# Altium schematic sheet SoC_Connector.SchDoc
size A3; SheetNumber: 4; SheetTotal: 6
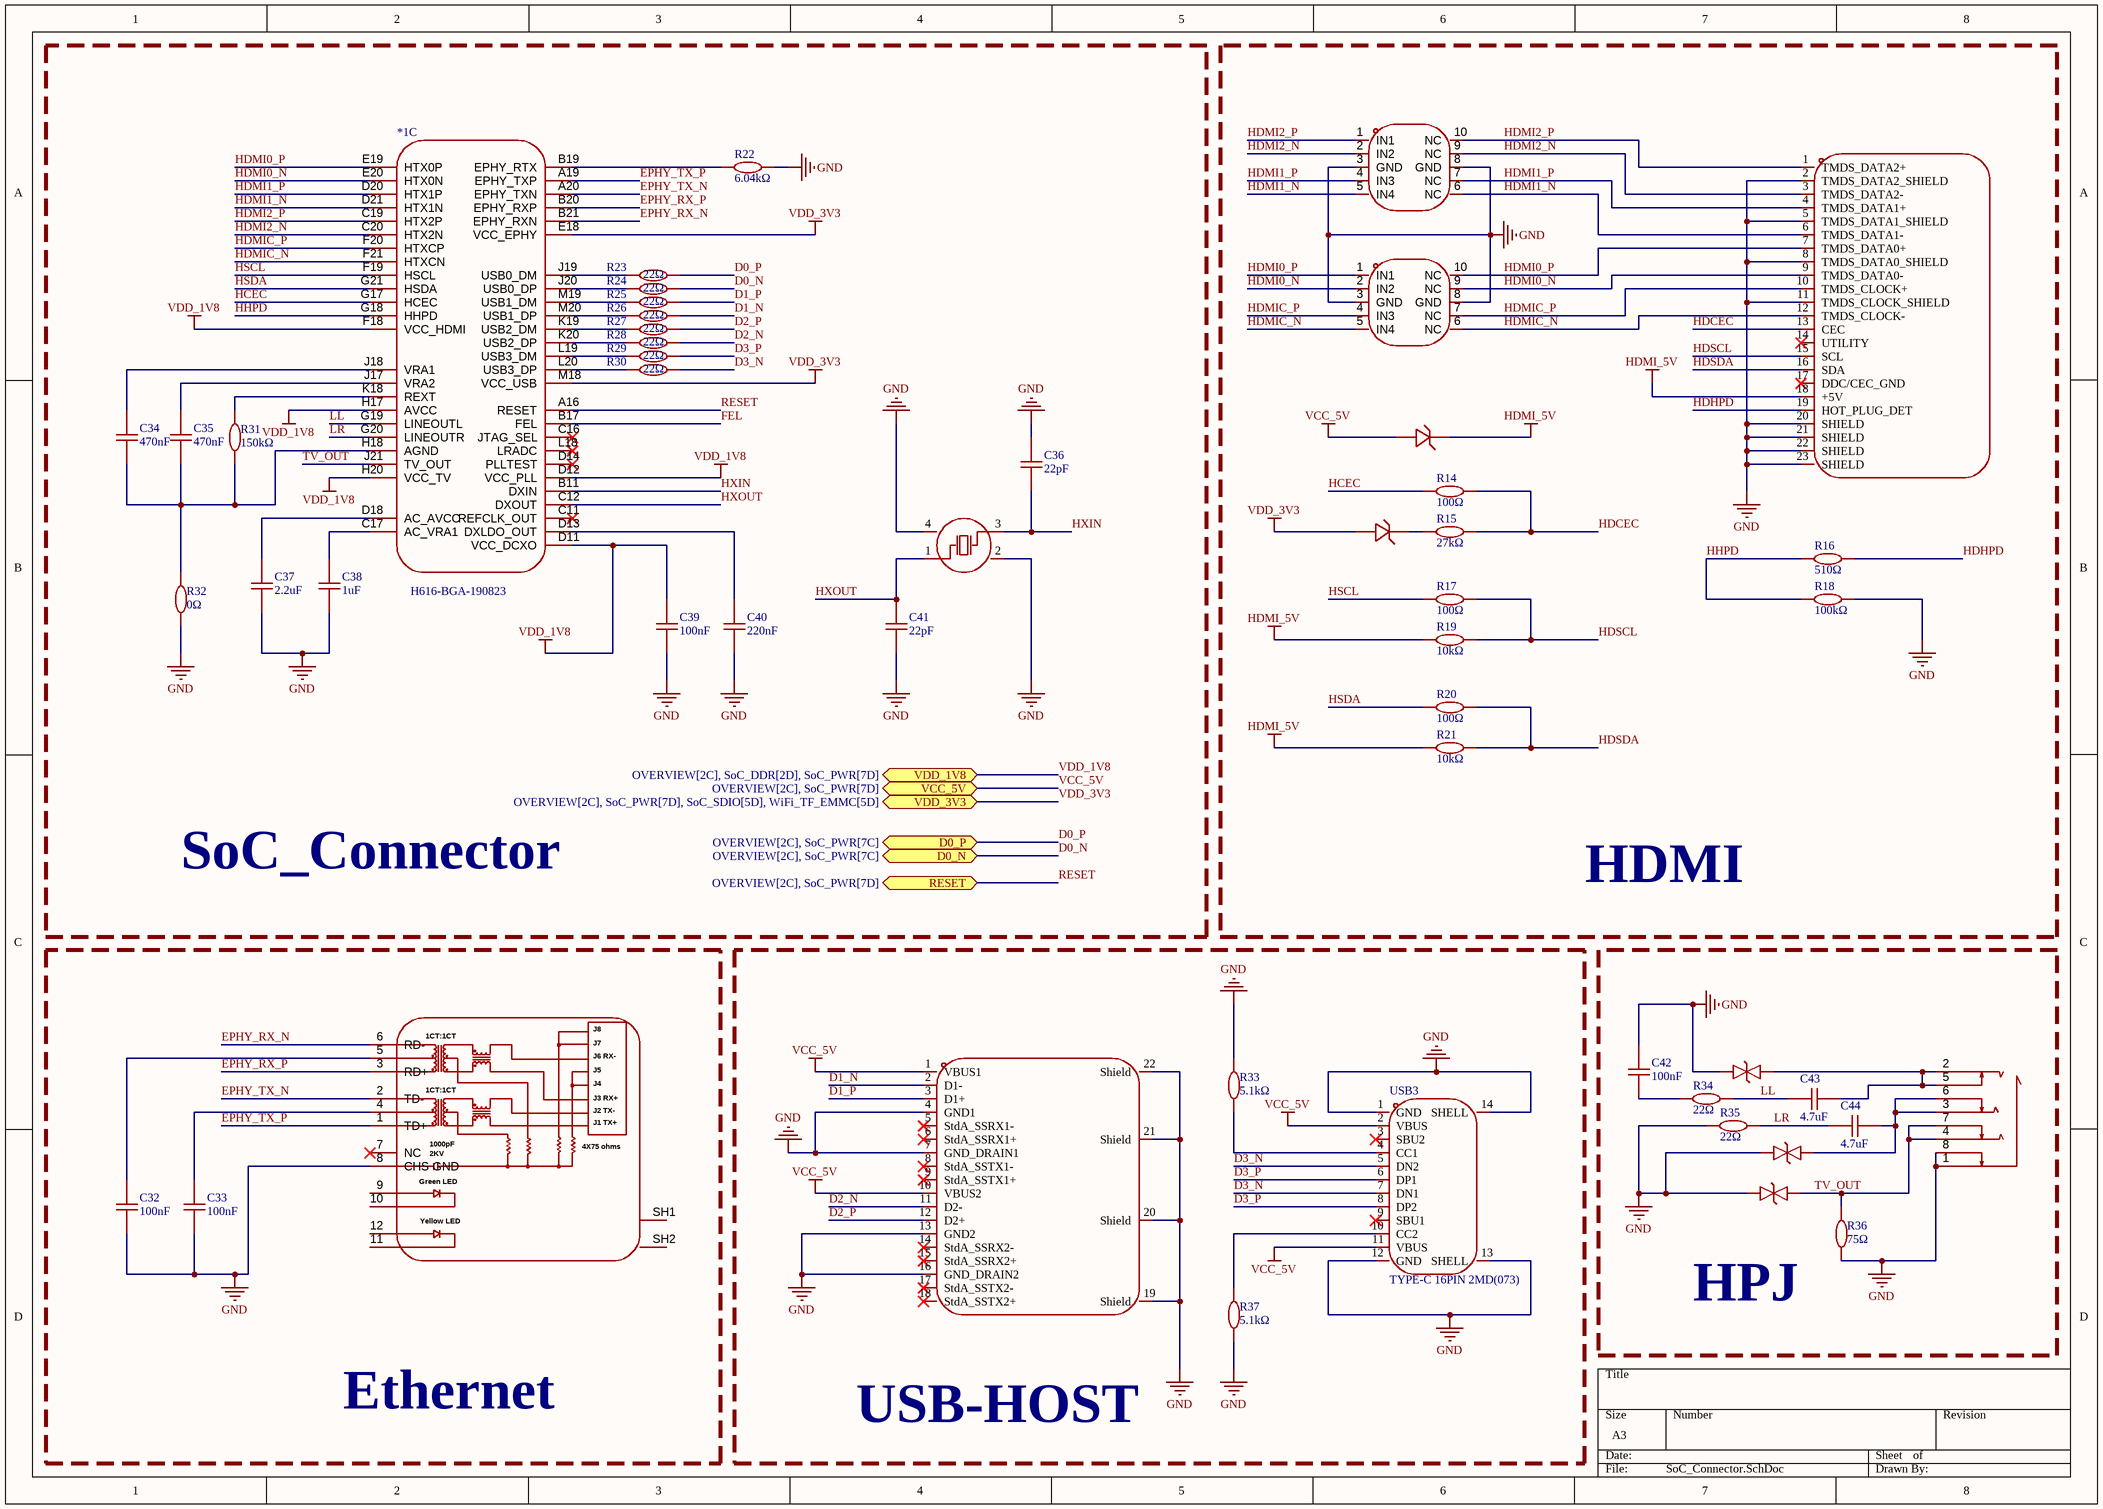
[diagram p0: SoC_Connector.SchDoc]

## Parts
*1  H616-BGA-190823  [BGA-284_L14.0-W12.0-P0.65-TL]  (part C of 4)
AUDIO1  PJ-3930-8A  [AUDIO-TH_PJ-3930-8A]  (value not drawn)
C32  100nF  [C0402]
C33  100nF  [C0402]
C34  470nF  [C0402]
C35  470nF  [C0402]
C36  22pF  [C0402]
C37  2.2uF  [C0402]
C38  1uF  [C0402]
C39  100nF  [C0402]
C40  220nF  [C0402]
C41  22pF  [C0402]
C42  100nF  [C0402]
C43  4.7uF  [C0402]
C44  4.7uF  [C0402]
CN1  KH-HDMI-19P-Cu  [HDMI-SMD_KH-HDMI-19P-CU]  (value not drawn)
D2  RClamp0524PATCT  [SLP2510P8_L2.5-W1.0-P0.50-BL]  (value not drawn)
D3  RClamp0524PATCT  [SLP2510P8_L2.5-W1.0-P0.50-BL]  (value not drawn)
D4  DSK24  [SOD-123FL_L2.7-W1.8-LS3.8-RD]  (value not drawn)
D5  DSK24  [SOD-123FL_L2.7-W1.8-LS3.8-RD]  (value not drawn)
J1  HR911105A_C12074  [RJ45-TH_HR911105A]  (value not drawn)
R14  100Ω  [R0402]
R15  27kΩ  [R0402]
R16  510Ω  [R0402]
R17  100Ω  [R0402]
R18  100kΩ  [R0402]
R19  10kΩ  [R0402]
R20  100Ω  [R0402]
R21  10kΩ  [R0402]
R22  6.04kΩ  [R0402]
R23  22Ω  [R0402]
R24  22Ω  [R0402]
R25  22Ω  [R0402]
R26  22Ω  [R0402]
R27  22Ω  [R0402]
R28  22Ω  [R0402]
R29  22Ω  [R0402]
R30  22Ω  [R0402]
R31  150kΩ  [R0402]
R32  0Ω  [R0402]
R33  5.1kΩ  [R0402]
R34  22Ω  [R0402]
R35  22Ω  [R0402]
R36  75Ω  [R0402]
R37  5.1kΩ  [R0402]
U3  ESD5451N  [DFN1006-2L-BI]  (value not drawn)
U4  ESD5451N  [DFN1006-2L-BI]  (value not drawn)
U5  ESD5451N  [DFN1006-2L-BI]  (value not drawn)
USB2  USB-303WSD-BRY  [USB-A-TH_XUNPU_USB-303WSD-BRY]  (value not drawn)
USB3  TYPE-C 16PIN 2MD(073)  [USB-C-SMD_TYPE-C-6PIN-2MD-073]
X1  24MHz  [CRYSTAL-SMD_4P-L3.2-W2.5-BL]  (value not drawn)

## Blocks framed on the sheet
SoC_Connector: *1 C34-C41 R22-R32 X1
HDMI: CN1 D2-D5 R14-R21
Ethernet: C32 C33 J1
USB-HOST: R33 R37 USB2 USB3
HPJ: AUDIO1 C42-C44 R34-R36 U3-U5

## Ports
D0_N (bidir, see OVERVIEW[2C], SoC_PWR[7C]), D0_P (bidir, see OVERVIEW[2C], SoC_PWR[7C]), RESET (bidir, see OVERVIEW[2C], SoC_PWR[7D]), VCC_5V (bidir, see OVERVIEW[2C], SoC_PWR[7D]), VDD_1V8 (bidir, see OVERVIEW[2C], SoC_DDR[2D], SoC_PWR[7D]), VDD_3V3 (bidir, see OVERVIEW[2C], SoC_PWR[7D], SoC_SDIO[5D], WiFi_TF_EMMC[5D])

## Nets
GND: AUDIO1.1 AUDIO1.8 C32.1 C33.1 C36.2 C37.1 C38.1 C39.1 C40.1 C41.1 C42.2 CN1.2(TMDS_DATA2_SHIELD) CN1.5(TMDS_DATA1_SHIELD) CN1.8(TMDS_DATA0_SHIELD) CN1.11(TMDS_CLOCK_SHIELD) CN1.20(SHIELD) CN1.21(SHIELD) CN1.22(SHIELD) CN1.23(SHIELD) D2.3(GND) D2.8(GND) D3.3(GND) D3.8(GND) J1.8(CHS_GND) R18.2 R22.2 R32.1 R33.2 R35.1 R36.1 R37.2 U3.1 U4.1 U5.1 USB2.4(GND1) USB2.7(GND_DRAIN1) USB2.13(GND2) USB2.16(GND_DRAIN2) USB2.19(Shield) USB2.20(Shield) USB2.21(Shield) USB2.22(Shield) USB3.1(GND) USB3.12(GND) USB3.13(SHELL) USB3.14(SHELL) X1.2(GND) X1.4(GND)
HDMI_5V: CN1.18(+5V) D4.1(C) R19.1 R21.1
VCC_5V: D4.2(A) USB2.1(VBUS1) USB2.10(VBUS2) USB3.2(VBUS) USB3.11(VBUS) ; port VCC_5V
VDD_1V8: *1.D11(VCC_DCXO) *1.D12(VCC_PLL) *1.F18(VCC_HDMI) *1.H17(AVCC) *1.H20(VCC_TV) C39.2 ; port VDD_1V8
VDD_3V3: *1.E18(VCC_EPHY) *1.M18(VCC_USB) D5.2(A) ; port VDD_3V3
D0_N: R24.2 ; port D0_N
D0_P: R23.2 ; port D0_P
D1_N: R26.2 USB2.2(D1-)
D1_P: R25.2 USB2.3(D1+)
D2_N: R28.2 USB2.11(D2-)
D2_P: R27.2 USB2.12(D2+)
D3_N: R30.2 USB3.5(DN2) USB3.7(DN1)
D3_P: R29.2 USB3.6(DP1) USB3.8(DP2)
EPHY_RX_N: *1.B21(EPHY_RXN) J1.6(RD-)
EPHY_RX_P: *1.B20(EPHY_RXP) J1.3(RD+)
EPHY_TX_N: *1.A20(EPHY_TXN) J1.2(TD-)
EPHY_TX_P: *1.A19(EPHY_TXP) J1.1(TD+)
FEL: *1.B17(FEL)
HCEC: *1.G17(HCEC) R14.1
HDCEC: CN1.13(CEC) R14.2 R15.2
HDHPD: CN1.19(HOT_PLUG_DET) R16.2
HDMI0_N: *1.E20(HTX0N) CN1.9(TMDS_DATA0-) D3.2(IN2) D3.9(NC)
HDMI0_P: *1.E19(HTX0P) CN1.7(TMDS_DATA0+) D3.1(IN1) D3.10(NC)
HDMI1_N: *1.D21(HTX1N) CN1.6(TMDS_DATA1-) D2.5(IN4) D2.6(NC)
HDMI1_P: *1.D20(HTX1P) CN1.4(TMDS_DATA1+) D2.4(IN3) D2.7(NC)
HDMI2_N: *1.C20(HTX2N) CN1.3(TMDS_DATA2-) D2.2(IN2) D2.9(NC)
HDMI2_P: *1.C19(HTX2P) CN1.1(TMDS_DATA2+) D2.1(IN1) D2.10(NC)
HDMIC_N: *1.F21(HTXCN) CN1.12(TMDS_CLOCK-) D3.5(IN4) D3.6(NC)
HDMIC_P: *1.F20(HTXCP) CN1.10(TMDS_CLOCK+) D3.4(IN3) D3.7(NC)
HDSCL: CN1.15(SCL) R17.2 R19.2
HDSDA: CN1.16(SDA) R20.2 R21.2
HHPD: *1.G18(HHPD) R16.1 R18.1
HSCL: *1.F19(HSCL) R17.1
HSDA: *1.G21(HSDA) R20.1
HXIN: *1.B11(DXIN) C36.1 X1.3(OSC2)
HXOUT: *1.C12(DXOUT) C41.2 X1.1(OSC1)
LL: *1.G19(LINEOUTL) C43.1 R34.2
LR: *1.G20(LINEOUTR) C44.1 R35.2
RESET: *1.A16(RESET) ; port RESET
TV_OUT: *1.J21(TV_OUT) AUDIO1.4 AUDIO1.7 R36.2 U5.2
Net*1_B19: *1.B19(EPHY_RTX) R22.1
Net*1_C17: *1.C17(AC_VRA1) C38.2
Net*1_D13: *1.D13(DXLDO_OUT) C40.2
Net*1_D18: *1.D18(AC_AVCC) C37.2
Net*1_H18: *1.H18(AGND) C34.1 C35.1 R31.1 R32.2
Net*1_J17: *1.J17(VRA2) C35.2
Net*1_J18: *1.J18(VRA1) C34.2
Net*1_J19: *1.J19(USB0_DM) R23.1
Net*1_J20: *1.J20(USB0_DP) R24.1
Net*1_K18: *1.K18(REXT) R31.2
Net*1_K19: *1.K19(USB2_DM) R27.1
Net*1_K20: *1.K20(USB2_DP) R28.1
Net*1_L19: *1.L19(USB3_DM) R29.1
Net*1_L20: *1.L20(USB3_DP) R30.1
Net*1_M19: *1.M19(USB1_DM) R25.1
Net*1_M20: *1.M20(USB1_DP) R26.1
NetAUDIO1_2: AUDIO1.2 AUDIO1.5 C43.2 U3.2
NetAUDIO1_3: AUDIO1.3 AUDIO1.6 C44.2 U4.2
NetC32_2: C32.2 J1.5
NetC33_2: C33.2 J1.4
NetC42_1: C42.1 R34.1
NetD5_1: D5.1(C) R15.1
NetR33_1: R33.1 USB3.4(CC1)
NetR37_1: R37.1 USB3.10(CC2)

Not connected (* = marked no-connect by the designer): *1 C11(REFCLK_OUT)* C16(JTAG_SEL)* D14(PLLTEST)* L18(LRADC)*; CN1 14(UTILITY)* 17(DDC/CEC_GND)*; J1 7(NC)* 9 10 11 12 SH1 SH2; USB2 5(StdA_SSRX1-)* 6(StdA_SSRX1+)* 8(StdA_SSTX1-)* 9(StdA_SSTX1+)* 14(StdA_SSRX2-)* 15(StdA_SSRX2+)* 17(StdA_SSTX2-)* 18(StdA_SSTX2+)*; USB3 3(SBU2)* 9(SBU1)*

## Notes on the sheet
- (in symbol HR911105A_C12074) J8; 1CT:1CT; J7; J6 RX-; J5; J4; J3 RX+; J2 TX-; J1 TX+; 1000pF; 4X75 ohms; 2KV; Green LED; Yellow LED

## Library data of the parts
*1 = H616-BGA-190823: Allwinner H616; Symbol: H616-BGA-190823
AUDIO1 = PJ-3930-8A: 3.5mm耳机座; Symbol: PJ-3930-8A
C32 C33 C39 C42 = 100nF: 50V 100nF X7R ±10% 0402 Ceramic Capacitors ROHS
C34 C35 = 470nF: 25V 470nF X5R ±10% 0402 Ceramic Capacitors ROHS
C36 C41 = 22pF: 50V 22pF C0G ±5% 0402 Ceramic Capacitors ROHS
C37 = 2.2uF: 50V 2.2uF NP0 0402 Ceramic Capacitors ROHS
C38 = 1uF: 50V 1uF X5R ±10% 0402 Ceramic Capacitors ROHS
C40 = 220nF: 16V 220nF X7R ±10% 0402 Ceramic Capacitors ROHS
C43 C44 = 4.7uF: 10V 4.7uF X5R ±20% 0402 Ceramic Capacitors ROHS
CN1 = KH-HDMI-19P-Cu: HDMI-A SMD USB, DVI, HDMI Connector Assemblies ROHS; Manufacturer: kinghelm(金航标); Add into BOM: yes; Gender: Mother; Symbol: KH-HDMI-19P-CU; Device: KH-HDMI-19P-Cu; LCSC Part Name: KH-HDMI-19P-Cu; Supplier Part: C709361; Manufacturer Part: KH-HDMI-19P-Cu; Supplier Footprint: SMD; JLCPCB Part Class: Extended Part; Datasheet: https://atta.szlcsc.com/upload/public/pdf/source/20211208/D47DE7411E98B8CA58BDDFA754B04DEC.pdf; Supplier: LCSC; Convert to PCB: yes; Connector Type: HDMI-A; Number of Pins: 19P; Mounting Style: Horizontal attachment; Current Rating (Max): -; Rated Voltage (Max): -; Operating Temperature Range: -
D2 D3 = RClamp0524PATCT: ESD 5V截止 峰值浪涌电流：5A@8/20us; Symbol: RClamp0524PATCT
D4 D5 = DSK24: 电压:40V 电流:2A; Manufacturer: Littelfuse(美国力特); Manufacturer Part: SMAJ5.0A; Symbol: SMAJ5.0A-C83329; Device: SMAJ5.0A_C83329; Add into BOM: yes; Polarity: Unidirectional; Reverse Stand-Off Voltage (Vrwm): 5V; Clamping Voltage: 9.2V; Peak Pulse Current (Ipp): 43.5A; Peak Pulse Power Dissipation (Ppp): 400W; Voltage - Breakdown: 6.4V; Reverse Leakage Current (Ir): 800uA; Type: TVS; LCSC Part Name: 耐压/V 5V-440V 峰值脉冲功率 400W; Supplier Part: C83329; Supplier Footprint: DO-214AC(SMA); JLCPCB Part Class: Extended Part; Datasheet: https://item.szlcsc.com/datasheet/SMAJ5.0A/84493.html; Supplier: LCSC; Convert to PCB: yes; Operating Temperature: -65℃~+150℃
J1 = HR911105A_C12074: Ethernet 弯插 带LED; Symbol: HR911105A_C12074
R14 R17 R20 = 100Ω: 100Ω 62.5mW 50V ±100ppm/℃ Thick Film Resistor ±1% 0402 Chip Resistor - Surface Mount ROHS
R15 = 27kΩ: 小尺寸、重量轻。降低组装成本,与贴片机匹配。适用于波峰焊和回流焊
R16 = 510Ω: 510Ω 62.5mW 50V ±100ppm/℃ Thick Film Resistor ±1% 0402 Chip Resistor - Surface Mount ROHS
R18 = 100kΩ: 100kΩ 62.5mW 50V ±100ppm/℃ Thick Film Resistor ±1% 0402 Chip Resistor - Surface Mount ROHS
R19 R21 = 10kΩ: 62.5mW 10kΩ 50V ±100ppm/℃ Thick Film Resistor ±1% 0402 Chip Resistor - Surface Mount ROHS
R22 = 6.04kΩ: 6.04kΩ 62.5mW 50V ±100ppm/℃ Thick Film Resistor ±1% 0402 Chip Resistor - Surface Mount ROHS
R23-R30 R34 R35 = 22Ω: 小尺寸、重量轻。降低组装成本,与贴片机匹配。适用于波峰焊和回流焊
R31 = 150kΩ: 62.5mW 150kΩ 50V ±100ppm/℃ Thick Film Resistor ±1% 0402 Chip Resistor - Surface Mount ROHS
R32 = 0Ω: 0Ω 62.5mW 50V Thick Film Resistor ±1% 0402 Chip Resistor - Surface Mount ROHS
R33 R37 = 5.1kΩ: 5.1kΩ 62.5mW 50V ±100ppm/℃ Thick Film Resistor ±1% 0402 Chip Resistor - Surface Mount ROHS
R36 = 75Ω: 小尺寸、重量轻。降低组装成本,与贴片机匹配。适用于波峰焊和回流焊
U3-U5 = ESD5451N_C5261080: 9A 9.8V 8V Bidirectional 5V DFN1006-2L TVS Diodes ROHS; Manufacturer: HXY MOSFET(华轩阳电子); Add into BOM: yes; Reverse Leakage Current (Ir): 500nA; Number of Channels: 1.0; level of protection: IEC 61000-4-2; Junction Capacitance: 15pF; Symbol: ESD5451N_C5261080; Device: ESD5451N_C5261080; LCSC Part Name: 5V 15pF 双向; Supplier Part: C5261080; Manufacturer Part: ESD5451N; Supplier Footprint: DFN1006-2L; JLCPCB Part Class: Extended Part; Datasheet: https://item.szlcsc.com/datasheet/ESD5451N/5983779.html; Supplier: LCSC; Convert to PCB: yes; Polarity: Bidirectional; Reverse Stand-Off Voltage (Vrwm): 5V; Clamping Voltage: 9.8V; Peak Pulse Current (Ipp): 9A; Voltage - Breakdown: 8V; Type: ESD
USB2 = USB-303WSD-BRY: USB 3.0 2 9Px2 -30℃~+85℃ Type-A Through Hole,Right Angle USB, DVI, HDMI Connector Assemblies ROHS; Manufacturer: XUNPU(讯普); Add into BOM: yes; Protocol Standard: USB 3.0; Gender: Female; Number of Ports: 2; Current Rating-Power: 1.8A; Voltage Rating: 30V; Detection color: Blue; Symbol: USB-303WSD-BRY; Device: USB-303WSD-BRY; Supplier Part: C2895028; Manufacturer Part: USB-303WSD-BRY; Supplier Footprint: 插件; JLCPCB Part Class: Extended Part; Datasheet: https://item.szlcsc.com/datasheet/USB-303WSD-BRY/3132965.html; Supplier: LCSC; Convert to PCB: yes; Connector Type: Type-A; Mounting Type: Right Angle; Number of Contacts: 9Px2; Length: -; Operating Temperature: -30℃~+85℃; LCSC Part Name: Type-A 母 弯插
USB3 = TYPE-C 16PIN 2MD(073): 16pin type-c
X1 = X322524MOB4SI: Crystal Oscillator 12pF SMD3225-4P Crystals ROHS; Manufacturer: YXC(扬兴晶振); Add into BOM: yes; Normal temperature Frequency Tolerance: ±10ppm; Frequency Stability: ±20ppm; Symbol: X322524MOB4SI; Device: X322524MOB4SI; LCSC Part Name: YSX321SL 24MHZ 4P 3225 12PF ±10PPM -40~85℃ (±20PPM); Supplier Part: C70590; Manufacturer Part: X322524MOB4SI; Supplier Footprint: SMD3225-4P; JLCPCB Part Class: Extended Part; Datasheet: https://item.szlcsc.com/datasheet/X322524MOB4SI/71688.html; Supplier: LCSC; Convert to PCB: yes; Type: Surface Mount Crystal; Value: 24MHz; Load Capacitance: 12pF; Operating Temperature: -40℃~+85℃